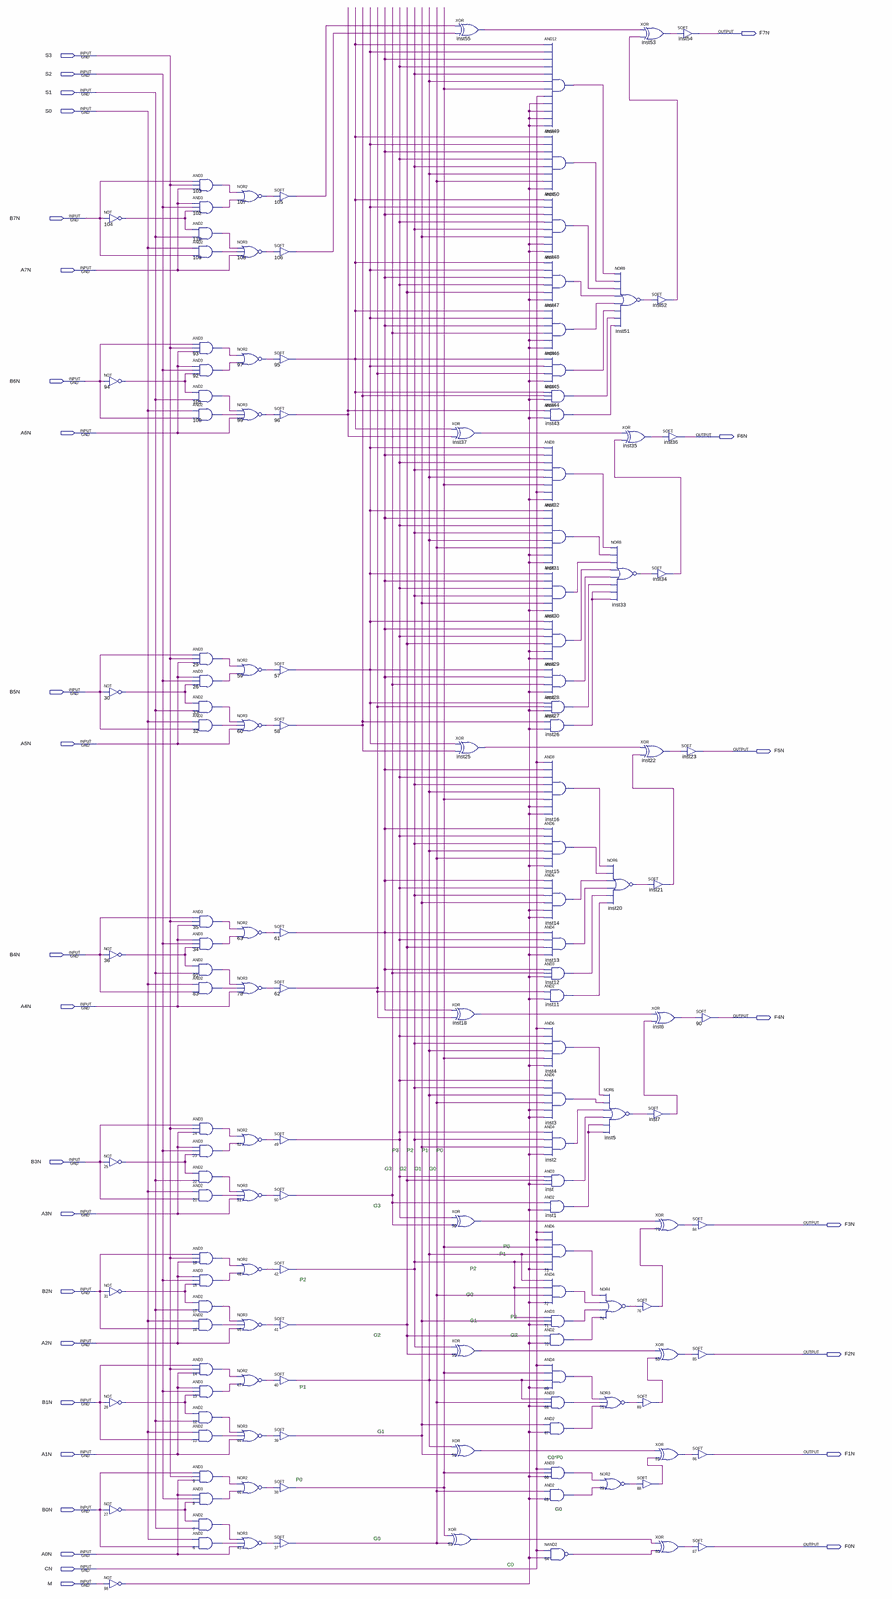
[diagram p0: schematic sheet, whole]
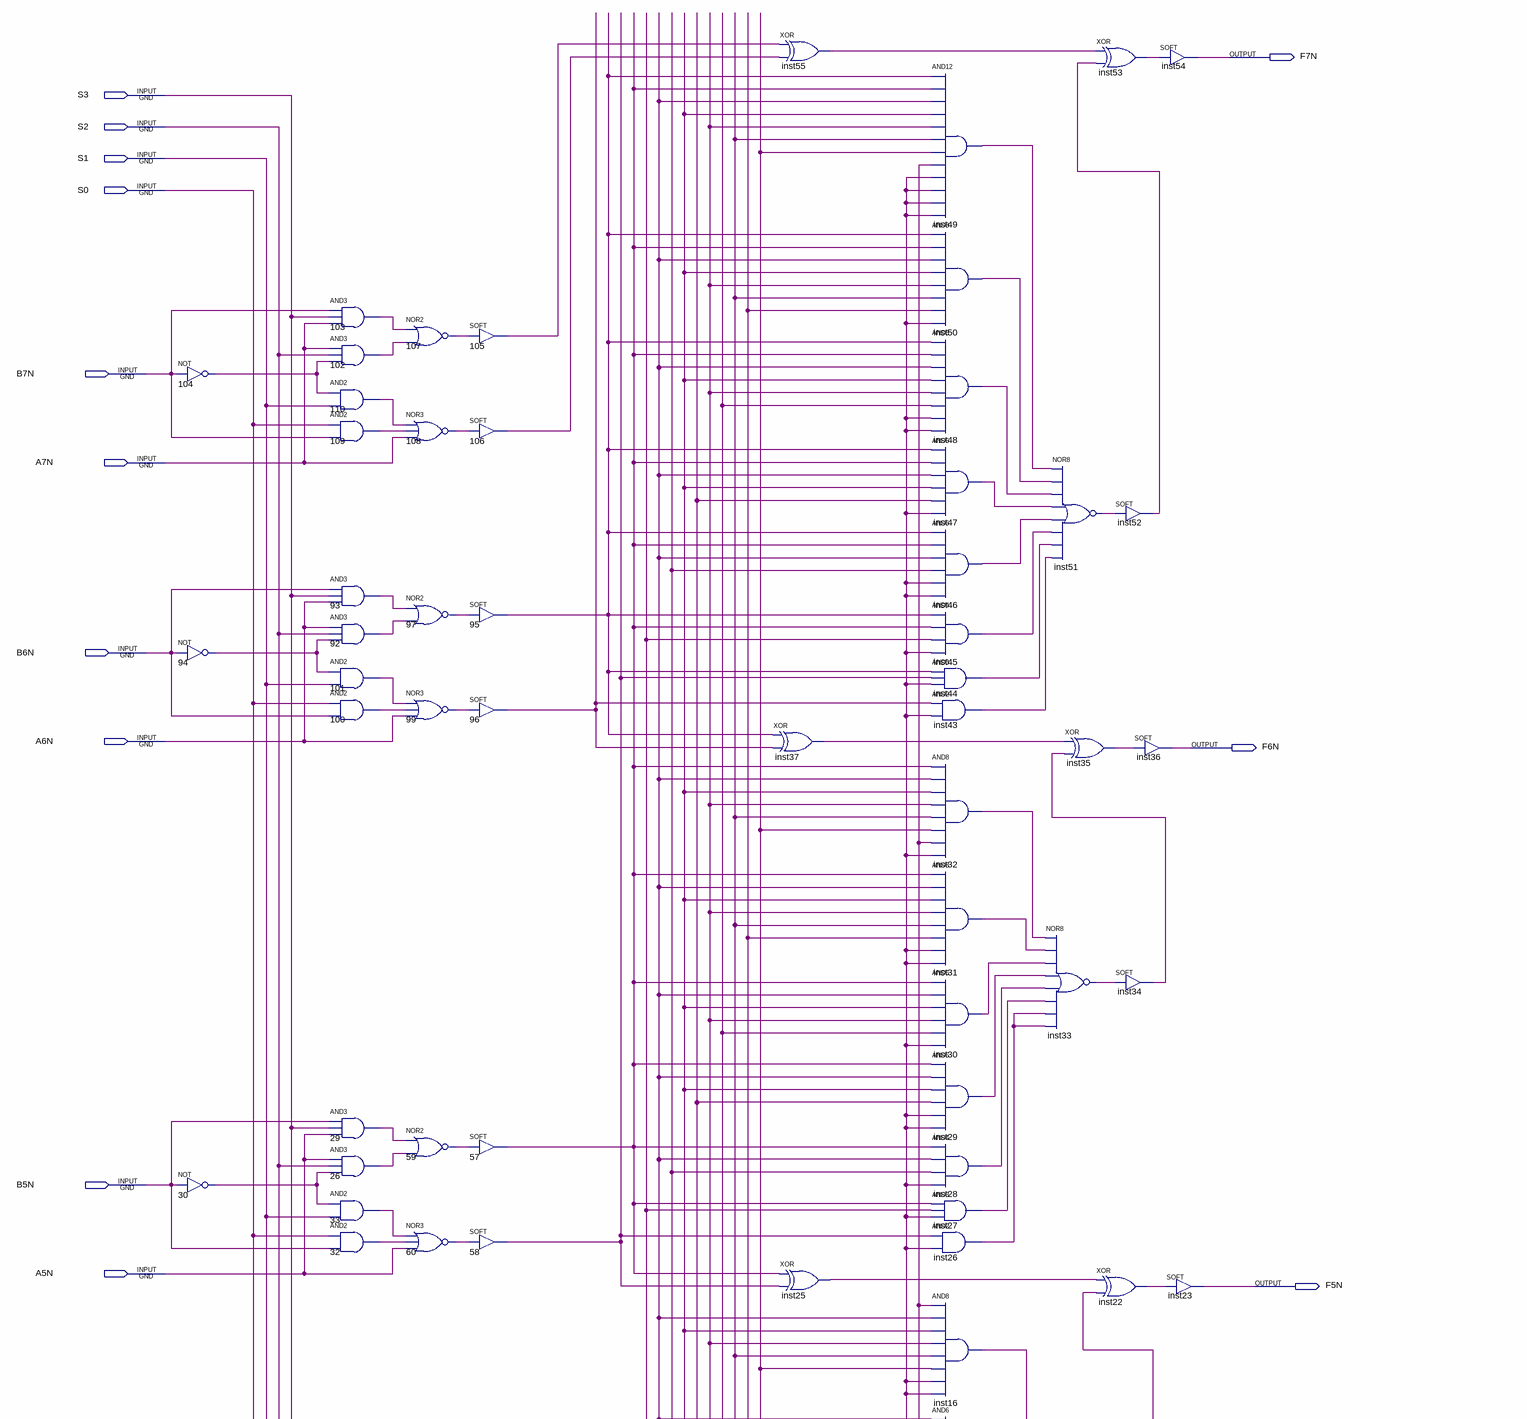
[diagram p1: schematic sheet, upper part]
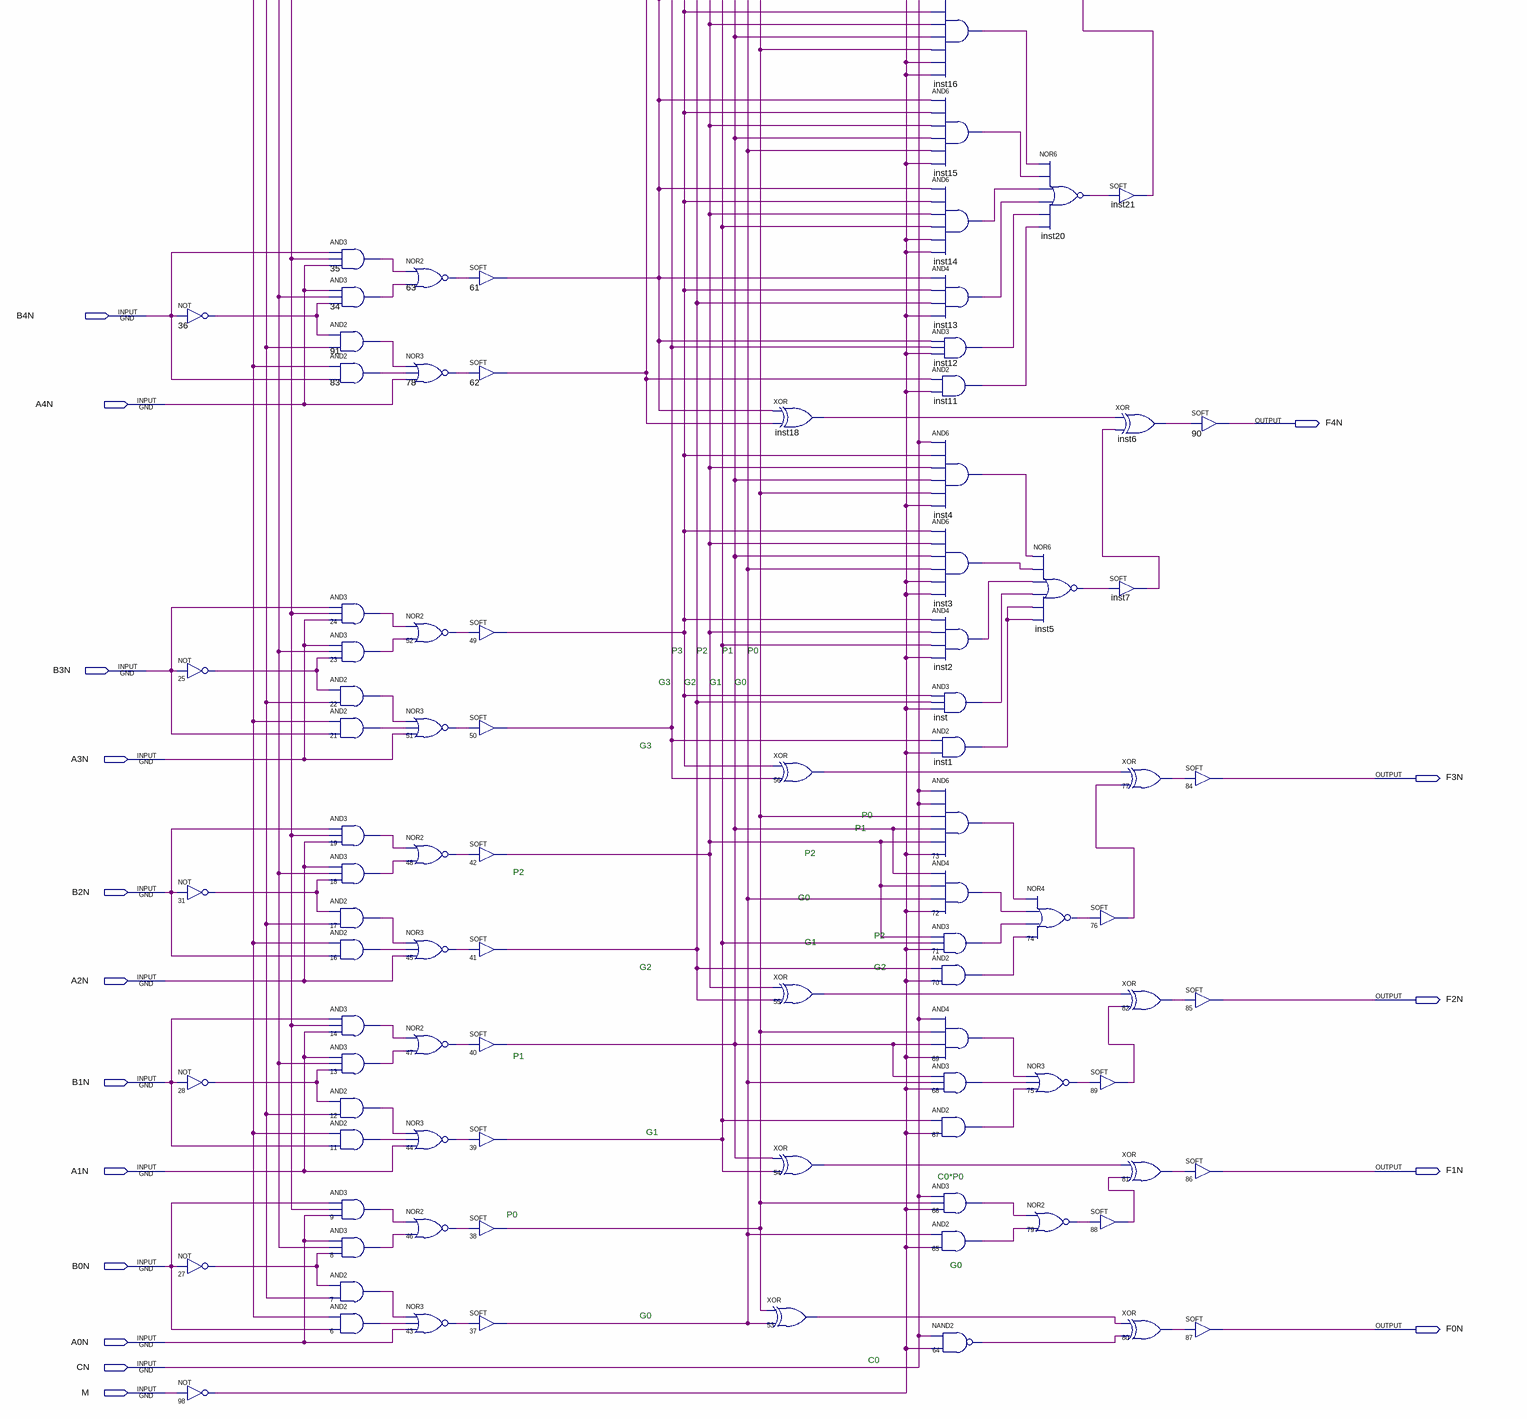
[diagram p2: schematic sheet, lower part]
// Quartus schematic 8bitAdder.bdf as structural Verilog: 147 symbols, 30 pins
module \8bitAdder  (
  input  S3,
  input  S2,
  input  S1,
  input  S0,
  input  B7N,
  input  A7N,
  input  B6N,
  input  A6N,
  input  B5N,
  input  A5N,
  input  B4N,
  input  A4N,
  input  B3N,
  input  A3N,
  input  B2N,
  input  A2N,
  input  B1N,
  input  A1N,
  input  B0N,
  input  A0N,
  input  CN,
  input  M,
  output F7N,
  output F6N,
  output F5N,
  output F4N,
  output F3N,
  output F2N,
  output F1N,
  output F0N
);

  wire inst1_out, inst2_out, inst3_out, inst4_out, inst5_out, inst6_out, inst7_out, inst11_out, inst12_out,
       inst13_out, inst14_out, inst15_out, inst16_out, inst18_out, inst20_out, inst21_out, inst22_out,
       inst25_out, inst26_out, inst27_out, inst28_out, inst29_out, inst30_out, inst31_out, inst32_out,
       inst33_out, inst34_out, inst35_out, inst37_out, inst43_out, inst44_out, inst45_out, inst46_out,
       inst47_out, inst48_out, inst49_out, inst50_out, inst51_out, inst52_out, inst53_out, inst55_out,
       inst_out, n6_out, n7_out, n8_out, n9_out, n11_out, n12_out, n13_out, n14_out, n16_out, n17_out,
       n18_out, n19_out, n21_out, n22_out, n23_out, n24_out, n25_out, n26_out, n27_out, n28_out, n29_out,
       n30_out, n31_out, n32_out, n33_out, n34_out, n35_out, n36_out, n37_out, n38_out, n39_out, n40_out,
       n41_out, n42_out, n43_out, n44_out, n45_out, n46_out, n47_out, n48_out, n49_out, n50_out, n51_out,
       n52_out, n53_out, n54_out, n55_out, n56_out, n57_out, n58_out, n59_out, n60_out, n61_out, n62_out,
       n63_out, n64_out, n65_out, n66_out, n67_out, n68_out, n69_out, n70_out, n71_out, n72_out, n73_out,
       n74_out, n75_out, n76_out, n77_out, n78_out, n79_out, n80_out, n81_out, n82_out, n83_out, n88_out,
       n89_out, n91_out, n92_out, n93_out, n94_out, n95_out, n96_out, n97_out, n98_out, n99_out, n100_out,
       n101_out, n102_out, n103_out, n104_out, n105_out, n106_out, n107_out, n108_out, n109_out, n110_out;

  not u_104 (n104_out, B7N);
  not u_94 (n94_out, B6N);
  not u_30 (n30_out, B5N);
  not u_36 (n36_out, B4N);
  not u_25 (n25_out, B3N);
  not u_31 (n31_out, B2N);
  not u_28 (n28_out, B1N);
  not u_27 (n27_out, B0N);
  not u_98 (n98_out, M);
  and u_103 (n103_out, B7N, S3, A7N);
  and u_102 (n102_out, A7N, S2, n104_out);
  and u_110 (n110_out, n104_out, S1);
  and u_109 (n109_out, S0, B7N);
  and u_93 (n93_out, B6N, S3, A6N);
  and u_92 (n92_out, A6N, S2, n94_out);
  and u_101 (n101_out, n94_out, S1);
  and u_100 (n100_out, S0, B6N);
  and u_29 (n29_out, B5N, S3, A5N);
  and u_26 (n26_out, A5N, S2, n30_out);
  and u_33 (n33_out, n30_out, S1);
  and u_32 (n32_out, S0, B5N);
  and u_35 (n35_out, B4N, S3, A4N);
  and u_34 (n34_out, A4N, S2, n36_out);
  and u_91 (n91_out, n36_out, S1);
  and u_83 (n83_out, S0, B4N);
  and u_24 (n24_out, B3N, S3, A3N);
  and u_23 (n23_out, A3N, S2, n25_out);
  and u_22 (n22_out, n25_out, S1);
  and u_21 (n21_out, S0, B3N);
  and u_19 (n19_out, B2N, S3, A2N);
  and u_18 (n18_out, A2N, S2, n31_out);
  and u_17 (n17_out, n31_out, S1);
  and u_16 (n16_out, S0, B2N);
  and u_14 (n14_out, B1N, S3, A1N);
  and u_13 (n13_out, A1N, S2, n28_out);
  and u_12 (n12_out, n28_out, S1);
  and u_11 (n11_out, S0, B1N);
  and u_9 (n9_out, B0N, S3, A0N);
  and u_8 (n8_out, A0N, S2, n27_out);
  and u_7 (n7_out, n27_out, S1);
  and u_6 (n6_out, S0, B0N);
  nor u_107 (n107_out, n103_out, n102_out);
  nor u_108 (n108_out, n110_out, n109_out, A7N);
  nor u_97 (n97_out, n93_out, n92_out);
  nor u_99 (n99_out, n101_out, n100_out, A6N);
  nor u_59 (n59_out, n29_out, n26_out);
  nor u_60 (n60_out, n33_out, n32_out, A5N);
  nor u_63 (n63_out, n35_out, n34_out);
  nor u_78 (n78_out, n91_out, n83_out, A4N);
  nor u_52 (n52_out, n24_out, n23_out);
  nor u_51 (n51_out, n22_out, n21_out, A3N);
  nor u_48 (n48_out, n19_out, n18_out);
  nor u_45 (n45_out, n17_out, n16_out, A2N);
  nor u_47 (n47_out, n14_out, n13_out);
  nor u_44 (n44_out, n12_out, n11_out, A1N);
  nor u_46 (n46_out, n9_out, n8_out);
  nor u_43 (n43_out, n7_out, n6_out, A0N);
  SOFT u_105 (.IN(n107_out), .OUT(n105_out));
  SOFT u_106 (.IN(n108_out), .OUT(n106_out));
  SOFT u_95 (.IN(n97_out), .OUT(n95_out));
  SOFT u_96 (.IN(n99_out), .OUT(n96_out));
  SOFT u_57 (.IN(n59_out), .OUT(n57_out));
  SOFT u_58 (.IN(n60_out), .OUT(n58_out));
  SOFT u_61 (.IN(n63_out), .OUT(n61_out));
  SOFT u_62 (.IN(n78_out), .OUT(n62_out));
  SOFT u_49 (.IN(n52_out), .OUT(n49_out));
  SOFT u_50 (.IN(n51_out), .OUT(n50_out));
  SOFT u_42 (.IN(n48_out), .OUT(n42_out));
  SOFT u_41 (.IN(n45_out), .OUT(n41_out));
  SOFT u_40 (.IN(n47_out), .OUT(n40_out));
  SOFT u_39 (.IN(n44_out), .OUT(n39_out));
  SOFT u_38 (.IN(n46_out), .OUT(n38_out));
  SOFT u_37 (.IN(n43_out), .OUT(n37_out));
  xor inst55 (inst55_out, n105_out, n106_out);
  xor inst37 (inst37_out, n95_out, n96_out);
  xor inst25 (inst25_out, n57_out, n58_out);
  xor inst18 (inst18_out, n61_out, n62_out);
  xor u_56 (n56_out, n49_out, n50_out);
  xor u_55 (n55_out, n42_out, n41_out);
  xor u_54 (n54_out, n40_out, n39_out);
  xor u_53 (n53_out, n38_out, n37_out);
  and inst49 (inst49_out, n95_out, n57_out, n61_out, n49_out, n42_out, n40_out, n38_out, CN, n98_out, n98_out, n98_out, n98_out);
  and inst50 (inst50_out, n95_out, n57_out, n61_out, n49_out, n42_out, n40_out, n37_out, n98_out);
  and inst48 (inst48_out, n95_out, n57_out, n61_out, n49_out, n42_out, n39_out, n98_out, n98_out);
  and inst47 (inst47_out, n95_out, n57_out, n61_out, n49_out, n41_out, n98_out);
  and inst46 (inst46_out, n95_out, n57_out, n61_out, n50_out, n98_out, n98_out);
  and inst45 (inst45_out, n95_out, n57_out, n62_out, n98_out);
  and inst44 (inst44_out, n95_out, n58_out, n98_out);
  and inst43 (inst43_out, n96_out, n98_out);
  and inst32 (inst32_out, n57_out, n61_out, n49_out, n42_out, n40_out, n38_out, CN, n98_out);
  and inst31 (inst31_out, n57_out, n61_out, n49_out, n42_out, n40_out, n37_out, n98_out, n98_out);
  and inst30 (inst30_out, n57_out, n61_out, n49_out, n42_out, n39_out, n98_out);
  and inst29 (inst29_out, n57_out, n61_out, n49_out, n41_out, n98_out, n98_out);
  and inst28 (inst28_out, n57_out, n61_out, n50_out, n98_out);
  and inst27 (inst27_out, n57_out, n62_out, n98_out);
  and inst26 (inst26_out, n58_out, n98_out);
  and inst16 (inst16_out, CN, n61_out, n49_out, n42_out, n40_out, n38_out, n98_out, n98_out);
  and inst15 (inst15_out, n61_out, n49_out, n42_out, n40_out, n37_out, n98_out);
  and inst14 (inst14_out, n61_out, n49_out, n42_out, n39_out, n98_out, n98_out);
  and inst13 (inst13_out, n61_out, n49_out, n41_out, n98_out);
  and inst12 (inst12_out, n61_out, n50_out, n98_out);
  and inst11 (inst11_out, n62_out, n98_out);
  and inst4 (inst4_out, CN, n49_out, n42_out, n40_out, n38_out, n98_out);
  and inst3 (inst3_out, n49_out, n42_out, n40_out, n37_out, n98_out, n98_out);
  and inst2 (inst2_out, n49_out, n42_out, n39_out, n98_out);
  and inst (inst_out, n49_out, n41_out, n98_out);
  and inst1 (inst1_out, n50_out, n98_out);
  and u_73 (n73_out, CN, CN, n38_out, n40_out, n42_out, n98_out);
  and u_72 (n72_out, n40_out, n42_out, n37_out, n98_out);
  and u_71 (n71_out, n42_out, n39_out, n98_out);
  and u_70 (n70_out, n41_out, n98_out);
  and u_69 (n69_out, CN, n38_out, n40_out, n98_out);
  and u_68 (n68_out, n40_out, n37_out, n98_out);
  and u_67 (n67_out, n39_out, n98_out);
  and u_66 (n66_out, CN, n38_out, n98_out);
  and u_65 (n65_out, n37_out, n98_out);
  nand u_64 (n64_out, CN, n98_out);
  nor inst20 (inst20_out, inst16_out, inst15_out, inst14_out, inst13_out, inst12_out, inst11_out);
  nor inst5 (inst5_out, inst4_out, inst3_out, inst2_out, inst_out, inst1_out, inst1_out);
  nor u_74 (n74_out, n73_out, n72_out, n71_out, n70_out);
  nor u_75 (n75_out, n69_out, n68_out, n67_out);
  nor u_79 (n79_out, n66_out, n65_out);
  nor inst51 (inst51_out, inst49_out, inst50_out, inst48_out, inst47_out, inst46_out, inst45_out, inst44_out, inst43_out);
  xor inst35 (inst35_out, inst37_out, inst34_out);
  nor inst33 (inst33_out, inst32_out, inst31_out, inst30_out, inst29_out, inst28_out, inst27_out, inst26_out, inst26_out);
  SOFT u_76 (.IN(n74_out), .OUT(n76_out));
  SOFT u_89 (.IN(n75_out), .OUT(n89_out));
  SOFT u_88 (.IN(n79_out), .OUT(n88_out));
  xor inst53 (inst53_out, inst55_out, inst52_out);
  SOFT inst52 (.IN(inst51_out), .OUT(inst52_out));
  SOFT inst36 (.IN(inst35_out), .OUT(F6N));
  SOFT inst34 (.IN(inst33_out), .OUT(inst34_out));
  xor inst22 (inst22_out, inst25_out, inst21_out);
  SOFT inst21 (.IN(inst20_out), .OUT(inst21_out));
  xor inst6 (inst6_out, inst18_out, inst7_out);
  SOFT inst7 (.IN(inst5_out), .OUT(inst7_out));
  xor u_77 (n77_out, n56_out, n76_out);
  xor u_82 (n82_out, n55_out, n89_out);
  xor u_81 (n81_out, n54_out, n88_out);
  xor u_80 (n80_out, n53_out, n64_out);
  SOFT inst54 (.IN(inst53_out), .OUT(F7N));
  SOFT inst23 (.IN(inst22_out), .OUT(F5N));
  SOFT u_90 (.IN(inst6_out), .OUT(F4N));
  SOFT u_84 (.IN(n77_out), .OUT(F3N));
  SOFT u_85 (.IN(n82_out), .OUT(F2N));
  SOFT u_86 (.IN(n81_out), .OUT(F1N));
  SOFT u_87 (.IN(n80_out), .OUT(F0N));

  // Notes on the sheet:
  //   P3
  //   P2
  //   P1
  //   P0
  //   G3
  //   G2
  //   G1
  //   G0
  //   G3
  //   P0
  //   P1
  //   P2
  //   P2
  //   G0
  //   P2
  //   G1
  //   G2
  //   G2
  //   P1
  //   G1
  //   C0*P0
  //   P0
  //   G0
  //   G0
  //   C0
endmodule
